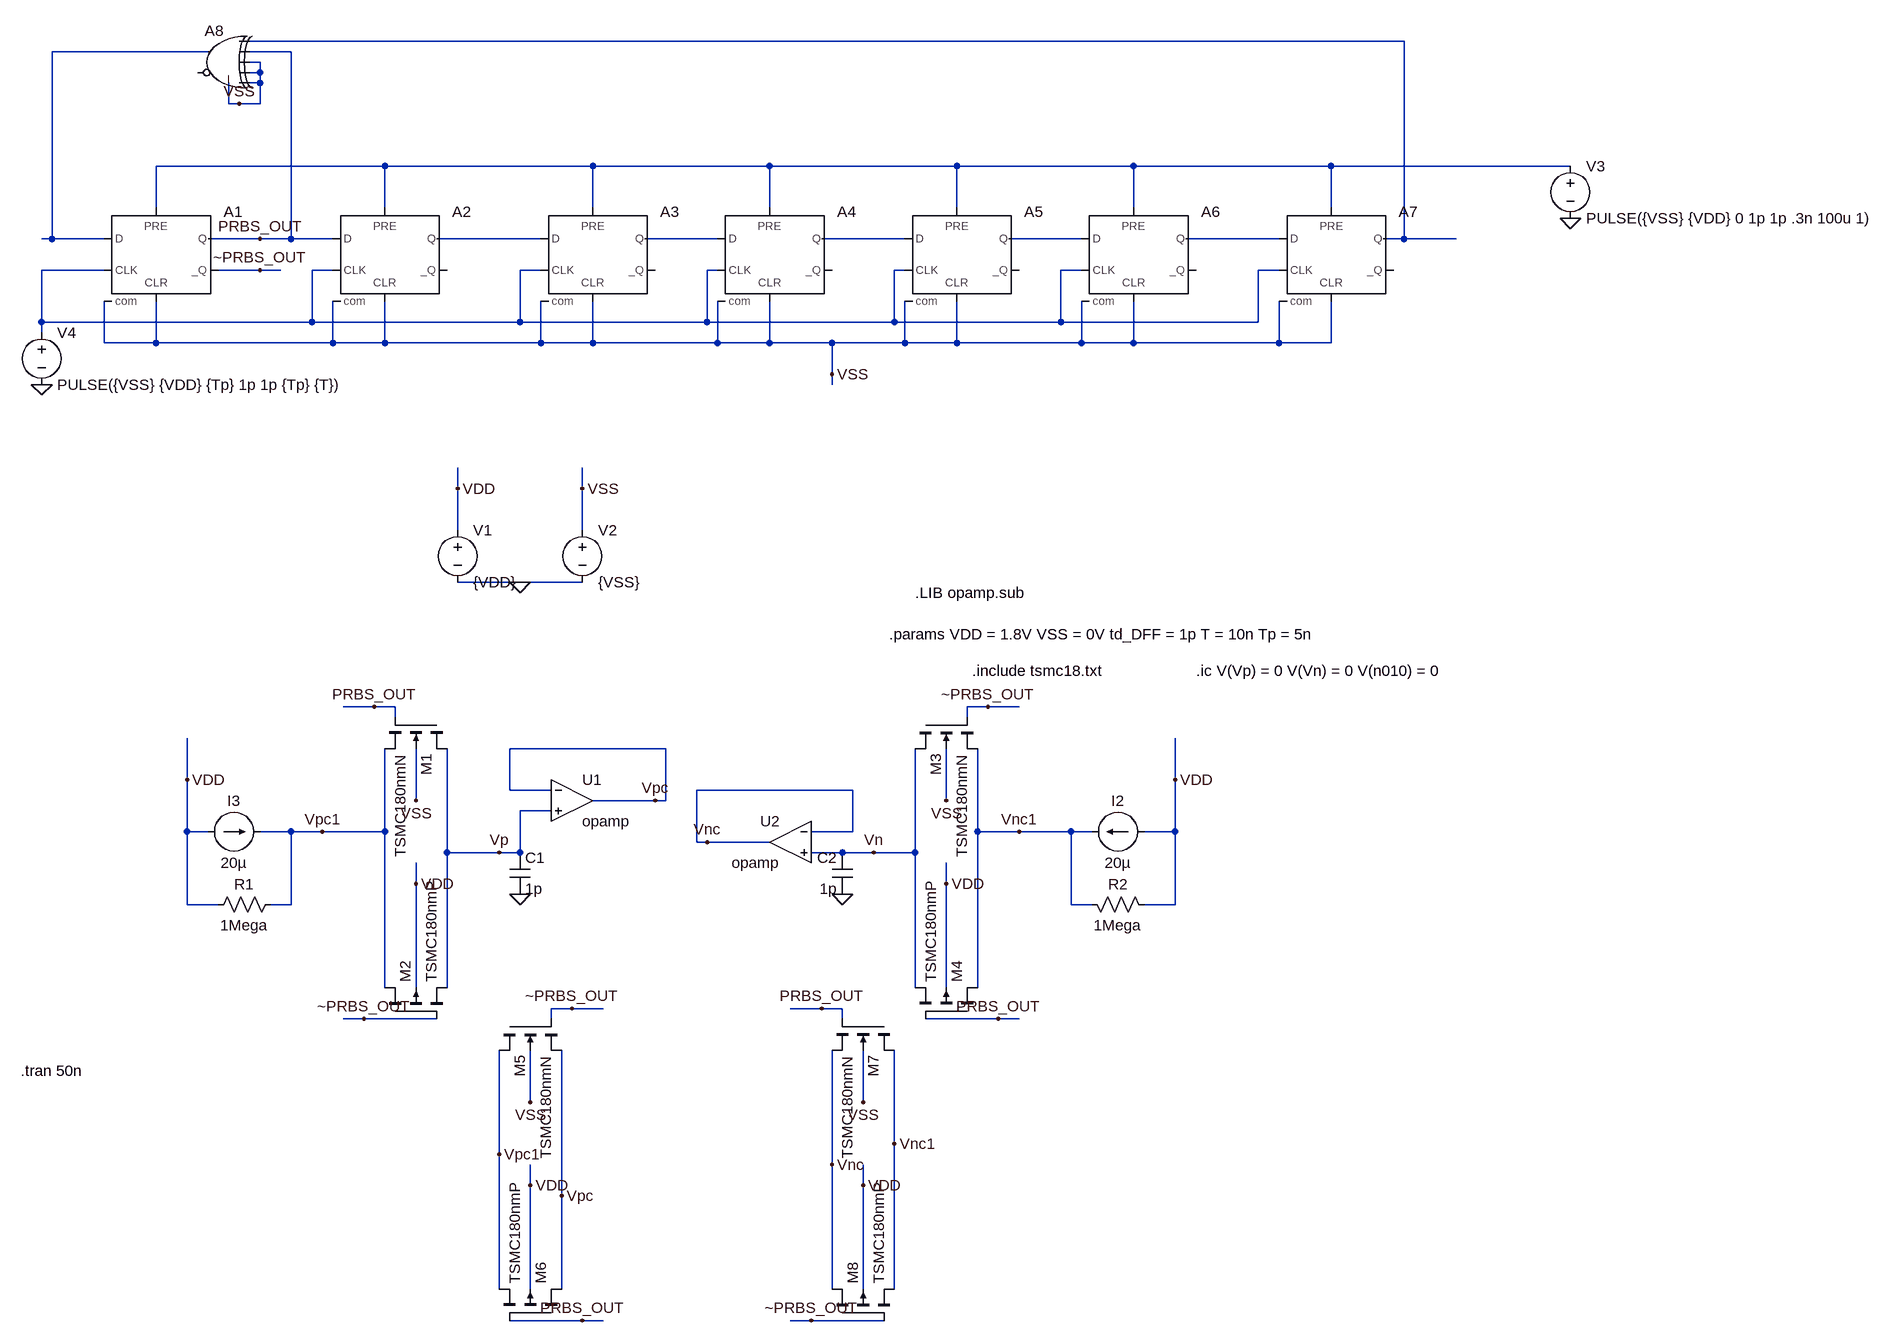
[diagram p0: schematic Current_Mode_Integrator0.asc]
Current_Mode_Integrator0.asc, the LTspice schematic file:
Version 4
SHEET 1 1720 1628
WIRE 960 -400 -816 -400
WIRE -880 -384 -1120 -384
WIRE -752 -384 -816 -384
WIRE -800 -368 -816 -368
WIRE -800 -352 -800 -368
WIRE -800 -352 -816 -352
WIRE -800 -336 -800 -352
WIRE -800 -336 -816 -336
WIRE -848 -304 -848 -336
WIRE -832 -304 -848 -304
WIRE -800 -304 -800 -336
WIRE -800 -304 -832 -304
WIRE -608 -208 -960 -208
WIRE -288 -208 -608 -208
WIRE -16 -208 -288 -208
WIRE 272 -208 -16 -208
WIRE 544 -208 272 -208
WIRE 848 -208 544 -208
WIRE 1216 -208 848 -208
WIRE -960 -144 -960 -208
WIRE -608 -144 -608 -208
WIRE -288 -144 -288 -208
WIRE -16 -144 -16 -208
WIRE 272 -144 272 -208
WIRE 544 -144 544 -208
WIRE 848 -144 848 -208
WIRE -1120 -96 -1120 -384
WIRE -1120 -96 -1136 -96
WIRE -1040 -96 -1120 -96
WIRE -800 -96 -880 -96
WIRE -752 -96 -752 -384
WIRE -752 -96 -800 -96
WIRE -688 -96 -752 -96
WIRE -368 -96 -528 -96
WIRE -96 -96 -208 -96
WIRE 192 -96 64 -96
WIRE 464 -96 352 -96
WIRE 768 -96 624 -96
WIRE 960 -96 960 -400
WIRE 960 -96 928 -96
WIRE 1040 -96 960 -96
WIRE -1040 -48 -1136 -48
WIRE -800 -48 -864 -48
WIRE -768 -48 -800 -48
WIRE -688 -48 -720 -48
WIRE -368 -48 -400 -48
WIRE -96 -48 -112 -48
WIRE 192 -48 176 -48
WIRE 464 -48 432 -48
WIRE 768 -48 736 -48
WIRE -1136 32 -1136 -48
WIRE -720 32 -720 -48
WIRE -720 32 -1136 32
WIRE -400 32 -400 -48
WIRE -400 32 -720 32
WIRE -112 32 -112 -48
WIRE -112 32 -400 32
WIRE 176 32 176 -48
WIRE 176 32 -112 32
WIRE 432 32 432 -48
WIRE 432 32 176 32
WIRE 736 32 736 -48
WIRE 736 32 432 32
WIRE -1136 48 -1136 32
WIRE -1040 64 -1040 0
WIRE -960 64 -960 0
WIRE -960 64 -1040 64
WIRE -688 64 -688 0
WIRE -688 64 -960 64
WIRE -608 64 -608 0
WIRE -608 64 -688 64
WIRE -368 64 -368 0
WIRE -368 64 -608 64
WIRE -288 64 -288 0
WIRE -288 64 -368 64
WIRE -96 64 -96 0
WIRE -96 64 -288 64
WIRE -16 64 -16 0
WIRE -16 64 -96 64
WIRE 80 64 -16 64
WIRE 192 64 192 0
WIRE 192 64 80 64
WIRE 272 64 272 0
WIRE 272 64 192 64
WIRE 464 64 464 0
WIRE 464 64 272 64
WIRE 544 64 544 0
WIRE 544 64 464 64
WIRE 768 64 768 0
WIRE 768 64 544 64
WIRE 848 64 848 0
WIRE 848 64 768 64
WIRE 80 112 80 64
WIRE 80 128 80 112
WIRE -496 288 -496 256
WIRE -304 288 -304 256
WIRE -496 352 -496 288
WIRE -304 352 -304 288
WIRE -400 432 -496 432
WIRE -304 432 -400 432
WIRE -624 624 -672 624
WIRE -592 624 -624 624
WIRE 320 624 288 624
WIRE 368 624 320 624
WIRE -592 640 -592 624
WIRE 288 640 288 624
WIRE -176 688 -416 688
WIRE -912 736 -912 672
WIRE 608 736 608 672
WIRE -416 752 -416 688
WIRE -352 752 -416 752
WIRE 112 752 -128 752
WIRE -560 768 -560 688
WIRE -192 768 -288 768
WIRE -176 768 -176 688
WIRE -176 768 -192 768
WIRE 256 768 256 688
WIRE -352 784 -400 784
WIRE -912 816 -912 736
WIRE -880 816 -912 816
WIRE -752 816 -800 816
WIRE -704 816 -752 816
WIRE -608 816 -608 688
WIRE -608 816 -704 816
WIRE 112 816 112 752
WIRE 112 816 48 816
WIRE 304 816 304 688
WIRE 368 816 304 816
WIRE 448 816 368 816
WIRE 480 816 448 816
WIRE 608 816 608 736
WIRE 608 816 560 816
WIRE -128 832 -128 752
WIRE -112 832 -128 832
WIRE -16 832 -112 832
WIRE -512 848 -512 688
WIRE -432 848 -512 848
WIRE -400 848 -400 784
WIRE -400 848 -432 848
WIRE 96 848 48 848
WIRE 144 848 96 848
WIRE 208 848 208 688
WIRE 208 848 144 848
WIRE -560 896 -560 864
WIRE 256 896 256 864
WIRE -912 928 -912 816
WIRE -864 928 -912 928
WIRE -752 928 -752 816
WIRE -752 928 -784 928
WIRE 448 928 448 816
WIRE 480 928 448 928
WIRE 608 928 608 816
WIRE 608 928 560 928
WIRE -608 1056 -608 816
WIRE -560 1056 -560 896
WIRE -512 1056 -512 848
WIRE 208 1056 208 848
WIRE 256 1056 256 896
WIRE 304 1056 304 816
WIRE -320 1088 -352 1088
WIRE -272 1088 -320 1088
WIRE 64 1088 16 1088
WIRE 96 1088 64 1088
WIRE -640 1104 -672 1104
WIRE -528 1104 -640 1104
WIRE -352 1104 -352 1088
WIRE 96 1104 96 1088
WIRE 336 1104 224 1104
WIRE 368 1104 336 1104
WIRE -384 1232 -384 1152
WIRE 128 1232 128 1152
WIRE 176 1296 176 1152
WIRE -432 1312 -432 1152
WIRE 80 1328 80 1152
WIRE -384 1360 -384 1328
WIRE 128 1360 128 1328
WIRE -336 1376 -336 1152
WIRE -432 1520 -432 1312
WIRE -384 1520 -384 1360
WIRE -336 1520 -336 1376
WIRE 80 1520 80 1328
WIRE 128 1520 128 1360
WIRE 176 1520 176 1296
WIRE -304 1568 -416 1568
WIRE -272 1568 -304 1568
WIRE 48 1568 16 1568
WIRE 160 1568 48 1568
FLAG -560 896 VDD
FLAG -560 768 VSS
FLAG -400 912 0
FLAG -400 432 0
FLAG -496 288 VDD
FLAG -304 288 VSS
FLAG 1216 -128 0
FLAG -1136 128 0
FLAG -832 -304 VSS
FLAG 80 112 VSS
FLAG -800 -96 PRBS_OUT
FLAG -800 -48 ~PRBS_OUT
FLAG -624 624 PRBS_OUT
FLAG -640 1104 ~PRBS_OUT
FLAG -912 736 VDD
FLAG 256 896 VDD
FLAG 256 768 VSS
FLAG 96 912 0
FLAG 320 624 ~PRBS_OUT
FLAG 336 1104 PRBS_OUT
FLAG 608 736 VDD
FLAG -432 848 Vp
FLAG 144 848 Vn
FLAG -192 768 Vpc
FLAG -704 816 Vpc1
FLAG -384 1360 VDD
FLAG -384 1232 VSS
FLAG -320 1088 ~PRBS_OUT
FLAG -304 1568 PRBS_OUT
FLAG -432 1312 Vpc1
FLAG -336 1376 Vpc
FLAG 128 1360 VDD
FLAG 128 1232 VSS
FLAG 64 1088 PRBS_OUT
FLAG 48 1568 ~PRBS_OUT
FLAG -112 832 Vnc
FLAG 368 816 Vnc1
FLAG 176 1296 Vnc1
FLAG 80 1328 Vnc
SYMBOL cap -416 848 R0
SYMATTR InstName C1
SYMATTR Value 1p
SYMBOL nmos4 -512 640 R90
SYMATTR InstName M1
SYMATTR Value TSMC180nmN
SYMATTR Value2 l=.5u w=2u
SYMBOL pmos4 -608 1104 R270
SYMATTR InstName M2
SYMATTR Value TSMC180nmP
SYMATTR Value2 l=.5u w=6u
SYMBOL voltage -496 336 R0
WINDOW 123 0 0 Left 0
WINDOW 39 0 0 Left 0
SYMATTR InstName V1
SYMATTR Value {VDD}
SYMBOL voltage -304 336 R0
WINDOW 123 0 0 Left 0
WINDOW 39 0 0 Left 0
SYMATTR InstName V2
SYMATTR Value {VSS}
SYMBOL Digital\\dflop -960 -144 R0
SYMATTR InstName A1
SYMATTR SpiceLine Trise = 1p Tfall = 1p Td = td_DFF
SYMATTR Value2 Vhigh = 1.8 Vlow = 0
SYMBOL Digital\\dflop -608 -144 R0
SYMATTR InstName A2
SYMATTR SpiceLine Trise = 1p Tfall = 1p Td = td_DFF
SYMATTR Value2 Vhigh = 1.8 Vlow = 0
SYMBOL Digital\\dflop -288 -144 R0
SYMATTR InstName A3
SYMATTR SpiceLine Trise = 1p Tfall = 1p Td = td_DFF
SYMATTR Value2 Vhigh = 1.8 Vlow = 0
SYMBOL Digital\\dflop -16 -144 R0
SYMATTR InstName A4
SYMATTR SpiceLine Trise = 1p Tfall = 1p Td = td_DFF
SYMATTR Value2 Vhigh = 1.8 Vlow = 0
SYMBOL Digital\\dflop 272 -144 R0
SYMATTR InstName A5
SYMATTR SpiceLine Trise = 1p Tfall = 1p Td = td_DFF
SYMATTR Value2 Vhigh = 1.8 Vlow = 0
SYMBOL Digital\\dflop 544 -144 R0
SYMATTR InstName A6
SYMATTR SpiceLine Trise = 1p Tfall = 1p Td = td_DFF
SYMATTR Value2 Vhigh = 1.8 Vlow = 0
SYMBOL Digital\\dflop 848 -144 R0
SYMATTR InstName A7
SYMATTR SpiceLine Trise = 1p Tfall = 1p Td = td_DFF
SYMATTR Value2 Vhigh = 1.8 Vlow = 0
SYMBOL Digital\\xor -864 -432 M0
SYMATTR InstName A8
SYMATTR Value2 Vhigh = 1.8 Vlow = 0
SYMBOL voltage 1216 -224 R0
WINDOW 123 0 0 Left 0
WINDOW 39 0 0 Left 0
SYMATTR InstName V3
SYMATTR Value PULSE({VSS} {VDD} 0 1p 1p .3n 100u 1)
SYMBOL voltage -1136 32 R0
WINDOW 123 0 0 Left 0
WINDOW 39 0 0 Left 0
SYMATTR InstName V4
SYMATTR Value PULSE({VSS} {VDD} {Tp} 1p 1p {Tp} {T})
SYMBOL res -768 912 R90
WINDOW 0 0 56 VBottom 2
WINDOW 3 32 56 VTop 2
SYMATTR InstName R1
SYMATTR Value 1Mega
SYMBOL cap 112 848 M0
SYMATTR InstName C2
SYMATTR Value 1p
SYMBOL nmos4 208 640 M90
SYMATTR InstName M3
SYMATTR Value TSMC180nmN
SYMATTR Value2 l=.5u w=2u
SYMBOL pmos4 304 1104 M270
SYMATTR InstName M4
SYMATTR Value TSMC180nmP
SYMATTR Value2 l=.5u w=6u
SYMBOL current 560 816 M270
WINDOW 0 32 40 VTop 2
WINDOW 3 -32 40 VBottom 2
WINDOW 123 0 0 Left 0
WINDOW 39 0 0 Left 0
SYMATTR InstName I2
SYMATTR Value 20µ
SYMBOL res 464 912 M90
WINDOW 0 0 56 VBottom 2
WINDOW 3 32 56 VTop 2
SYMATTR InstName R2
SYMATTR Value 1Mega
SYMBOL current -880 816 R270
WINDOW 0 32 40 VTop 2
WINDOW 3 -32 40 VBottom 2
WINDOW 123 0 0 Left 0
WINDOW 39 0 0 Left 0
SYMATTR InstName I3
SYMATTR Value 20µ
SYMBOL nmos4 -432 1104 M90
SYMATTR InstName M5
SYMATTR Value TSMC180nmN
SYMATTR Value2 l=.5u w=2u
SYMBOL pmos4 -336 1568 M270
SYMATTR InstName M6
SYMATTR Value TSMC180nmP
SYMATTR Value2 l=.5u w=6u
SYMBOL Opamps\\opamp -320 704 R0
SYMATTR InstName U1
SYMATTR SpiceLine2 GBW=1000Meg
SYMBOL nmos4 176 1104 R90
SYMATTR InstName M7
SYMATTR Value TSMC180nmN
SYMATTR Value2 l=.5u w=2u
SYMBOL pmos4 80 1568 R270
SYMATTR InstName M8
SYMATTR Value TSMC180nmP
SYMATTR Value2 l=.5u w=6u
SYMBOL Opamps\\opamp 16 768 M0
SYMATTR InstName U2
SYMATTR SpiceLine2 GBW=1000Meg
TEXT 296 568 Left 2 !.include tsmc18.txt
TEXT 168 512 Left 2 !.params VDD = 1.8V VSS = 0V td_DFF = 1p T = 10n Tp = 5n
TEXT -1168 1184 Left 2 !.tran 50n
TEXT 640 568 Left 2 !.ic V(Vp) = 0 V(Vn) = 0 V(n010) = 0
TEXT 208 448 Left 2 !.LIB opamp.sub

The netlist it stands for:
* Current_Mode_Integrator0.asc
C1 Vp 0 1p
M1 Vp PRBS_OUT Vpc1 VSS TSMC180nmN l=.5u w=2u
M2 Vpc1 ~PRBS_OUT Vp VDD TSMC180nmP l=.5u w=6u
V1 VDD 0 {VDD}
V2 VSS 0 {VSS}
A1 N002 VSS N009 N003 VSS ~PRBS_OUT PRBS_OUT VSS DFLOP Vhigh = 1.8 Vlow = 0 Trise = 1p Tfall = 1p Td = td_DFF
A2 PRBS_OUT VSS N009 N003 VSS VSS N004 VSS DFLOP Vhigh = 1.8 Vlow = 0 Trise = 1p Tfall = 1p Td = td_DFF
A3 N004 VSS N009 N003 VSS VSS N005 VSS DFLOP Vhigh = 1.8 Vlow = 0 Trise = 1p Tfall = 1p Td = td_DFF
A4 N005 VSS N009 N003 VSS VSS N006 VSS DFLOP Vhigh = 1.8 Vlow = 0 Trise = 1p Tfall = 1p Td = td_DFF
A5 N006 VSS N009 N003 VSS VSS N007 VSS DFLOP Vhigh = 1.8 Vlow = 0 Trise = 1p Tfall = 1p Td = td_DFF
A6 N007 VSS N009 N003 VSS VSS N008 VSS DFLOP Vhigh = 1.8 Vlow = 0 Trise = 1p Tfall = 1p Td = td_DFF
A7 N008 VSS N009 N003 VSS VSS N001 VSS DFLOP Vhigh = 1.8 Vlow = 0 Trise = 1p Tfall = 1p Td = td_DFF
A8 N001 PRBS_OUT VSS VSS VSS VSS N002 VSS XOR Vhigh = 1.8 Vlow = 0
V3 N003 0 PULSE({VSS} {VDD} 0 1p 1p .3n 100u 1)
V4 N009 0 PULSE({VSS} {VDD} {Tp} 1p 1p {Tp} {T})
R1 Vpc1 VDD 1Mega
C2 Vn 0 1p
M3 Vn ~PRBS_OUT Vnc1 VSS TSMC180nmN l=.5u w=2u
M4 Vnc1 PRBS_OUT Vn VDD TSMC180nmP l=.5u w=6u
I2 VDD Vnc1 20µ
R2 Vnc1 VDD 1Mega
I3 VDD Vpc1 20µ
M5 Vpc1 ~PRBS_OUT Vpc VSS TSMC180nmN l=.5u w=2u
M6 Vpc PRBS_OUT Vpc1 VDD TSMC180nmP l=.5u w=6u
XU1 Vpc Vp Vpc opamp Aol=100K GBW=1000Meg  ; pins invin noninvin out
M7 Vnc1 PRBS_OUT Vnc VSS TSMC180nmN l=.5u w=2u
M8 Vnc ~PRBS_OUT Vnc1 VDD TSMC180nmP l=.5u w=6u
XU2 Vnc Vn Vnc opamp Aol=100K GBW=1000Meg  ; pins invin noninvin out
.model NMOS NMOS
.model PMOS PMOS
.lib standard.mos
.include tsmc18.txt
.params VDD = 1.8V VSS = 0V td_DFF = 1p T = 10n Tp = 5n
.tran 50n
.ic V(Vp) = 0 V(Vn) = 0 V(n010) = 0
.LIB opamp.sub
.backanno
.end